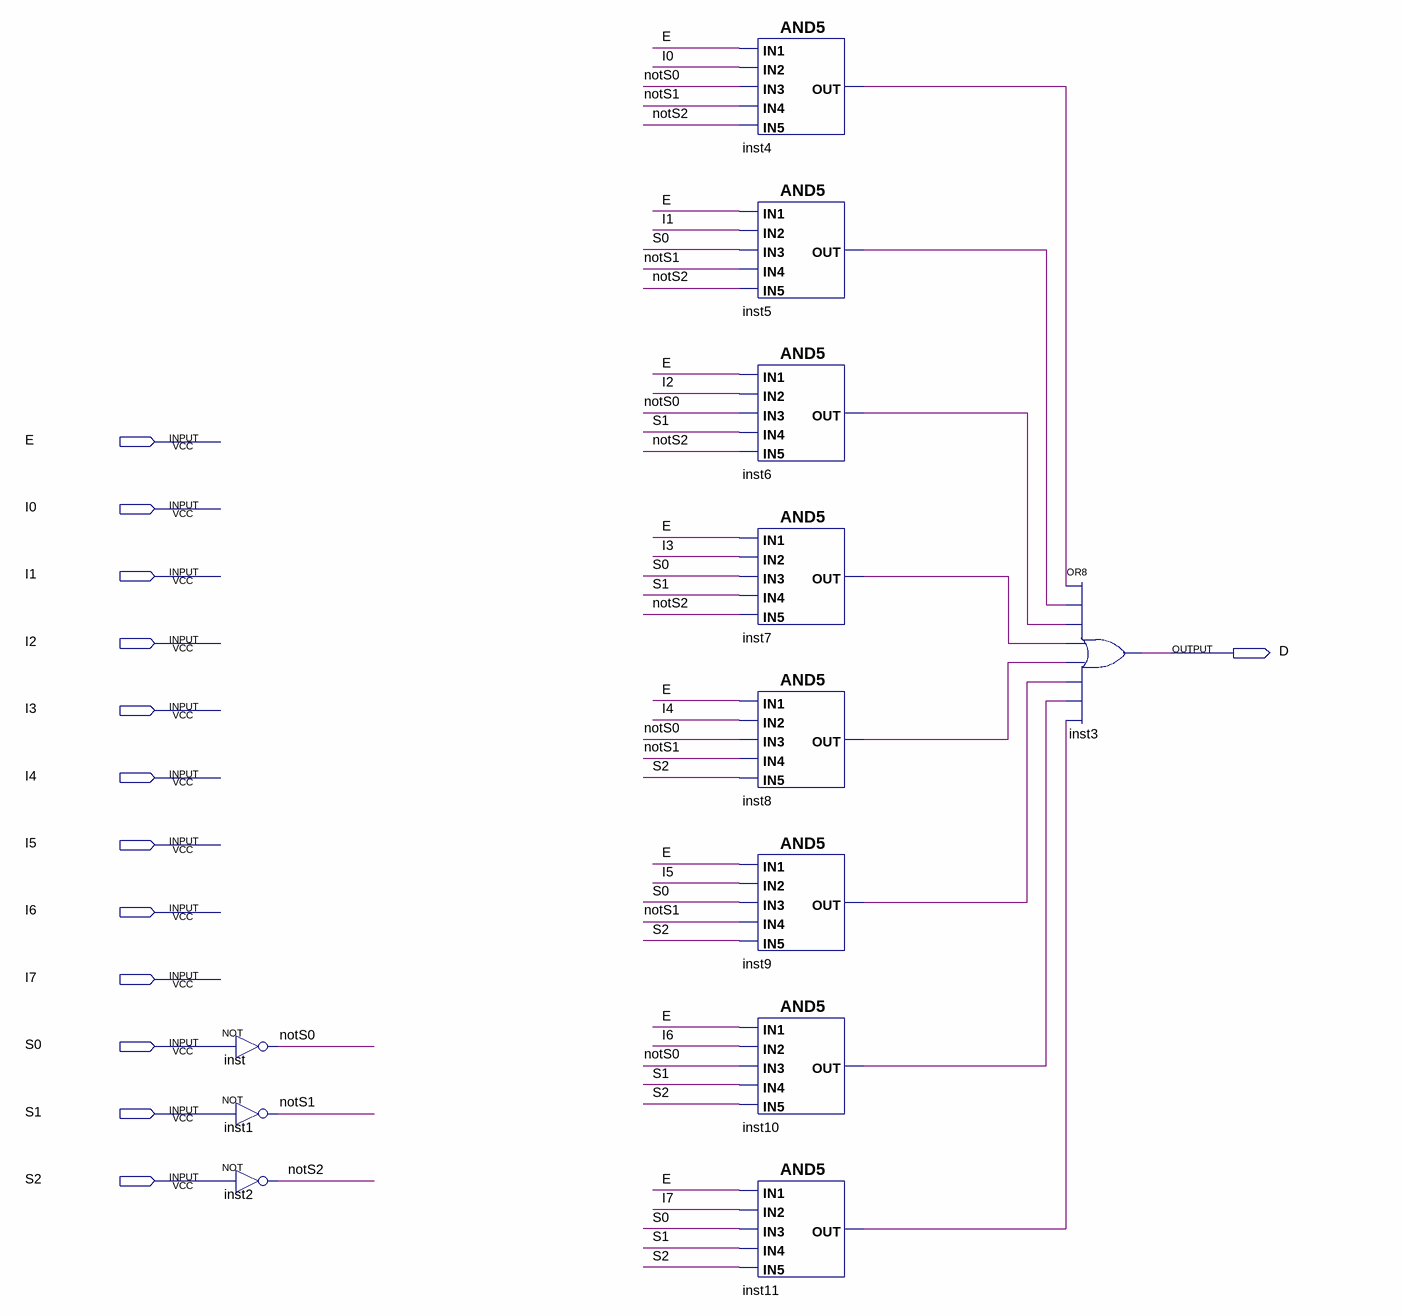
[diagram p0: schematic sheet]
// Quartus schematic mp8-1_1.bdf as structural Verilog: 12 symbols, 13 pins
module \mp8-1_1  (
  input  E,
  input  I0,
  input  I1,
  input  I2,
  input  I3,
  input  I4,
  input  I5,
  input  I6,
  input  I7,
  input  S0,
  input  S1,
  input  S2,
  output D
);

  wire inst4_out, inst5_out, inst6_out, inst7_out, inst8_out, inst9_out, inst10_out, inst11_out, notS0,
       notS1, notS2;

  not inst (notS0, S0);
  not inst1 (notS1, S1);
  not inst2 (notS2, S2);
  and inst4 (inst4_out, E, I0, notS0, notS1, notS2);
  and inst5 (inst5_out, E, I1, S0, notS1, notS2);
  and inst6 (inst6_out, E, I2, notS0, S1, notS2);
  and inst7 (inst7_out, E, I3, S0, S1, notS2);
  and inst8 (inst8_out, E, I4, notS0, notS1, S2);
  and inst9 (inst9_out, E, I5, S0, notS1, S2);
  and inst10 (inst10_out, E, I6, notS0, S1, S2);
  and inst11 (inst11_out, E, I7, S0, S1, S2);
  or inst3 (D, inst4_out, inst5_out, inst6_out, inst7_out, inst8_out, inst9_out, inst10_out, inst11_out);
endmodule
